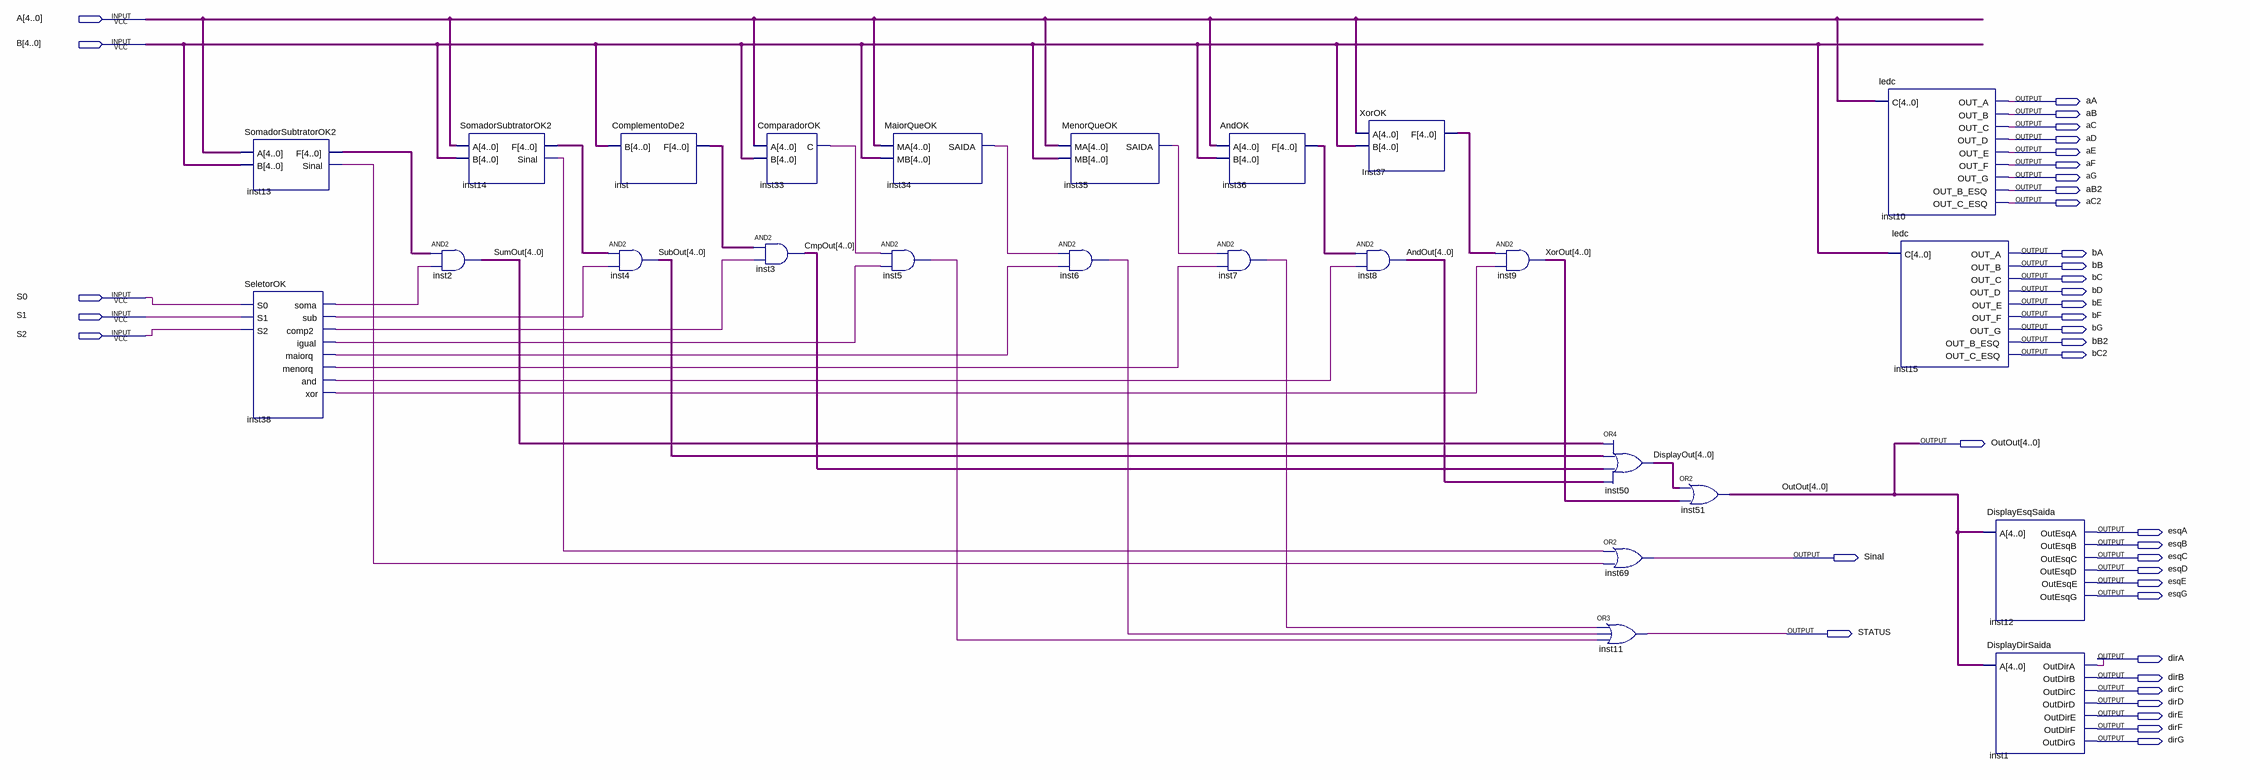
[diagram p0: schematic sheet]
// Quartus schematic ProjetoCompletoOK.bdf as structural Verilog: 25 symbols, 39 pins
module ProjetoCompletoOK (
  input  [4:0] A,
  input  [4:0] B,
  input  S0,
  input  S1,
  input  S2,
  output aA,
  output aB,
  output aC,
  output aD,
  output aE,
  output aF,
  output aG,
  output aB2,
  output aC2,
  output bA,
  output bB,
  output bC,
  output bD,
  output bE,
  output bF,
  output bG,
  output bB2,
  output bC2,
  output [4:0] OutOut,
  output esqA,
  output esqB,
  output Sinal,
  output esqC,
  output esqD,
  output esqE,
  output esqG,
  output STATUS,
  output dirA,
  output dirB,
  output dirC,
  output dirD,
  output dirE,
  output dirF,
  output dirG
);

  wire inst5_out, inst6_out, inst7_out, inst13_sinal, inst14_sinal, inst33_c, inst34_saida, inst35_saida,
       inst38_and, inst38_comp2, inst38_igual, inst38_maiorq, inst38_menorq, inst38_soma, inst38_sub,
       inst38_xor;
  wire [4:0] AndOut, CmpOut, DisplayOut, inst13_f, inst14_f, inst36_f, Inst37_f, inst_f, SubOut, SumOut,
       XorOut;

  SomadorSubtratorOK2 inst13 (.A(A), .B(B), .F(inst13_f), .Sinal(inst13_sinal));
  SeletorOK inst38 (
    .S0(S0), .S1(S1), .S2(S2), .soma(inst38_soma), .sub(inst38_sub), .comp2(inst38_comp2),
    .igual(inst38_igual), .maiorq(inst38_maiorq), .menorq(inst38_menorq), .\and (inst38_and),
    .\xor (inst38_xor));
  SomadorSubtratorOK2 inst14 (.A(A), .B(B), .F(inst14_f), .Sinal(inst14_sinal));
  assign SumOut = inst13_f & {5{inst38_soma}};  // AND2 inst2, 5 bits wide
  ComplementoDe2 inst (.B(B), .F(inst_f));
  assign SubOut = inst14_f & {5{inst38_sub}};  // AND2 inst4, 5 bits wide
  ComparadorOK inst33 (.A(A), .B(B), .C(inst33_c));
  assign CmpOut = inst_f & {5{inst38_comp2}};  // AND2 inst3, 5 bits wide
  MaiorQueOK inst34 (.MA(A), .MB(B), .SAIDA(inst34_saida));
  and inst5 (inst5_out, inst33_c, inst38_igual);
  MenorQueOK inst35 (.MA(A), .MB(B), .SAIDA(inst35_saida));
  and inst6 (inst6_out, inst34_saida, inst38_maiorq);
  AndOK inst36 (.A(A), .B(B), .F(inst36_f));
  and inst7 (inst7_out, inst35_saida, inst38_menorq);
  XorOK Inst37 (.A(A), .B(B), .F(Inst37_f));
  assign AndOut = inst36_f & {5{inst38_and}};  // AND2 inst8, 5 bits wide
  assign XorOut = Inst37_f & {5{inst38_xor}};  // AND2 inst9, 5 bits wide
  assign DisplayOut = SumOut | SubOut | CmpOut | AndOut;  // OR4 inst50, 5 bits wide
  or inst69 (Sinal, inst14_sinal, inst13_sinal);
  or inst11 (STATUS, inst7_out, inst6_out, inst5_out);
  assign OutOut = DisplayOut | XorOut;  // OR2 inst51, 5 bits wide
  ledc inst10 (
    .C(A), .OUT_A(aA), .OUT_B(aB), .OUT_C(aC), .OUT_D(aD), .OUT_E(aE), .OUT_F(aF), .OUT_G(aG),
    .OUT_B_ESQ(aB2), .OUT_C_ESQ(aC2));
  ledc inst15 (
    .C(B), .OUT_A(bA), .OUT_B(bB), .OUT_C(bC), .OUT_D(bD), .OUT_E(bE), .OUT_F(bF), .OUT_G(bG),
    .OUT_B_ESQ(bB2), .OUT_C_ESQ(bC2));
  DisplayEsqSaida inst12 (
    .A(OutOut), .OutEsqA(esqA), .OutEsqB(esqB), .OutEsqC(esqC), .OutEsqD(esqD), .OutEsqE(esqE), .OutEsqG(esqG));
  DisplayDirSaida inst1 (
    .A(OutOut), .OutDirA(dirA), .OutDirB(dirB), .OutDirC(dirC), .OutDirD(dirD), .OutDirE(dirE),
    .OutDirF(dirF), .OutDirG(dirG));
endmodule
